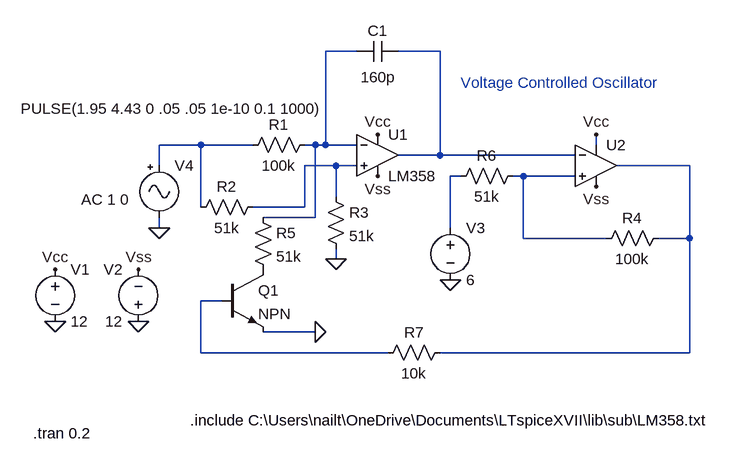
[diagram p0: schematic Voltage controlled oscillator.asc]
Voltage controlled oscillator.asc, the LTspice schematic file:
Version 4
SHEET 1 1176 680
WIRE 80 -80 32 -80
WIRE 208 -80 144 -80
WIRE -160 64 -224 64
WIRE -80 64 -160 64
WIRE 16 64 0 64
WIRE 32 64 32 -80
WIRE 32 64 16 64
WIRE 80 64 32 64
WIRE 448 64 448 48
WIRE 208 80 208 -80
WIRE 208 80 144 80
WIRE 416 80 208 80
WIRE -224 96 -224 64
WIRE 48 96 0 96
WIRE 80 96 48 96
WIRE 592 96 480 96
WIRE 240 112 224 112
WIRE 336 112 320 112
WIRE 416 112 336 112
WIRE 48 144 48 96
WIRE -160 160 -160 64
WIRE 0 160 0 96
WIRE 0 160 -80 160
WIRE 16 176 16 64
WIRE 16 176 -64 176
WIRE -224 192 -224 176
WIRE 224 192 224 112
WIRE 336 208 336 112
WIRE 464 208 336 208
WIRE 592 208 592 96
WIRE 592 208 544 208
WIRE 48 240 48 224
WIRE -128 304 -160 304
WIRE 16 352 -64 352
WIRE -160 384 -160 304
WIRE 128 384 -160 384
WIRE 592 384 592 208
WIRE 592 384 208 384
FLAG -384 256 Vcc
FLAG -256 256 Vss
FLAG 112 48 Vcc
FLAG 112 112 Vss
FLAG 48 240 0
FLAG 16 352 0
FLAG -384 336 0
FLAG -256 336 0
FLAG 448 48 Vcc
FLAG 448 128 Vss
FLAG 224 272 0
FLAG -224 192 0
SYMBOL voltage -384 240 R0
WINDOW 123 0 0 Left 2
WINDOW 39 0 0 Left 2
SYMATTR InstName V1
SYMATTR Value 12
SYMBOL voltage -256 352 R180
WINDOW 0 24 96 Left 2
WINDOW 3 24 16 Left 2
WINDOW 123 0 0 Left 2
WINDOW 39 0 0 Left 2
SYMATTR InstName V2
SYMATTR Value 12
SYMBOL res 16 48 R90
WINDOW 0 0 56 VBottom 2
WINDOW 3 32 56 VTop 2
SYMATTR InstName R1
SYMATTR Value 100k
SYMBOL res -64 144 R90
WINDOW 0 0 56 VBottom 2
WINDOW 3 32 56 VTop 2
SYMATTR InstName R2
SYMATTR Value 51k
SYMBOL res 32 128 R0
SYMATTR InstName R3
SYMATTR Value 51k
SYMBOL res 560 192 R90
WINDOW 0 0 56 VBottom 2
WINDOW 3 32 56 VTop 2
SYMATTR InstName R4
SYMATTR Value 100k
SYMBOL cap 144 -96 R90
WINDOW 0 0 32 VBottom 2
WINDOW 3 40 31 VTop 2
SYMATTR InstName C1
SYMATTR Value 160p
SYMBOL res -80 160 R0
SYMATTR InstName R5
SYMATTR Value 51k
SYMBOL Opamps\\UniversalOpamp2 448 96 R0
SYMATTR InstName U2
SYMBOL voltage 224 176 R0
WINDOW 123 0 0 Left 2
WINDOW 39 0 0 Left 2
SYMATTR InstName V3
SYMATTR Value 6
SYMBOL res 336 96 R90
WINDOW 0 0 56 VBottom 2
WINDOW 3 32 56 VTop 2
SYMATTR InstName R6
SYMATTR Value 51k
SYMBOL res 224 368 R90
WINDOW 0 0 56 VBottom 2
WINDOW 3 32 56 VTop 2
SYMATTR InstName R7
SYMATTR Value 10k
SYMBOL Misc\\signal -224 80 R0
WINDOW 123 -120 68 Left 2
WINDOW 39 0 0 Left 2
WINDOW 3 -213 -72 Left 2
SYMATTR Value2 AC 1 0
SYMATTR InstName V4
SYMATTR Value PULSE(1.95 4.43 0 .05 .05 1e-10 0.1 1000)
SYMBOL npn -128 256 R0
SYMATTR InstName Q1
SYMBOL Opamps\\opamp2 112 16 R0
SYMATTR InstName U1
SYMATTR Value LM358
TEXT -176 488 Left 2 !.include C:\\Users\\nailt\\OneDrive\\Documents\\LTspiceXVII\\lib\\sub\\LM358.txt
TEXT 240 -32 Left 2 ;Voltage Controlled Oscillator
TEXT -418 508 Left 2 !.tran 0.2

The netlist it stands for:
* Voltage controlled oscillator.asc
V1 Vcc 0 12
V2 0 Vss 12
R1 N001 N003 100k
R2 N004 N003 51k
R3 N004 0 51k
R4 N005 N007 100k
C1 N002 N001 160p
R5 N001 P001 51k
XU2 N007 N002 Vcc Vss N005 level.2 Avol=1Meg GBW=10Meg Slew=10Meg ilimit=25m rail=0 Vos=0 phimargin=45 en=0 enk=0 in=0 ink=0 Rin=500Meg  ; pins IN+ IN- V+ V- OUT
V3 N006 0 6
R6 N007 N006 51k
R7 N005 N008 10k
V4 N003 0 PULSE(1.95 4.43 0 .05 .05 1e-10 0.1 1000) AC 1 0
Q1 P001 N008 0 0 NPN
XU1 N004 N001 Vcc Vss N002 LM358  ; pins In+ In- V+ V- OUT
.model NPN NPN
.model PNP PNP
.lib standard.bjt
.include C:\Users\nailt\OneDrive\Documents\LTspiceXVII\lib\sub\LM358.txt
* Voltage Controlled Oscillator
.tran 0.2
.lib UniversalOpamps2.sub
.backanno
.end